# Altium schematic sheet 6_dc_dc_5V_Payloads.SchDoc: Payloads Step-Down Converters 5V/3A
size A4; DrawnBy: Sara V. Martínez; Engineer: Flight; DocumentNumber: 9; Revision: V0.1; SheetNumber: 9; SheetTotal: 11
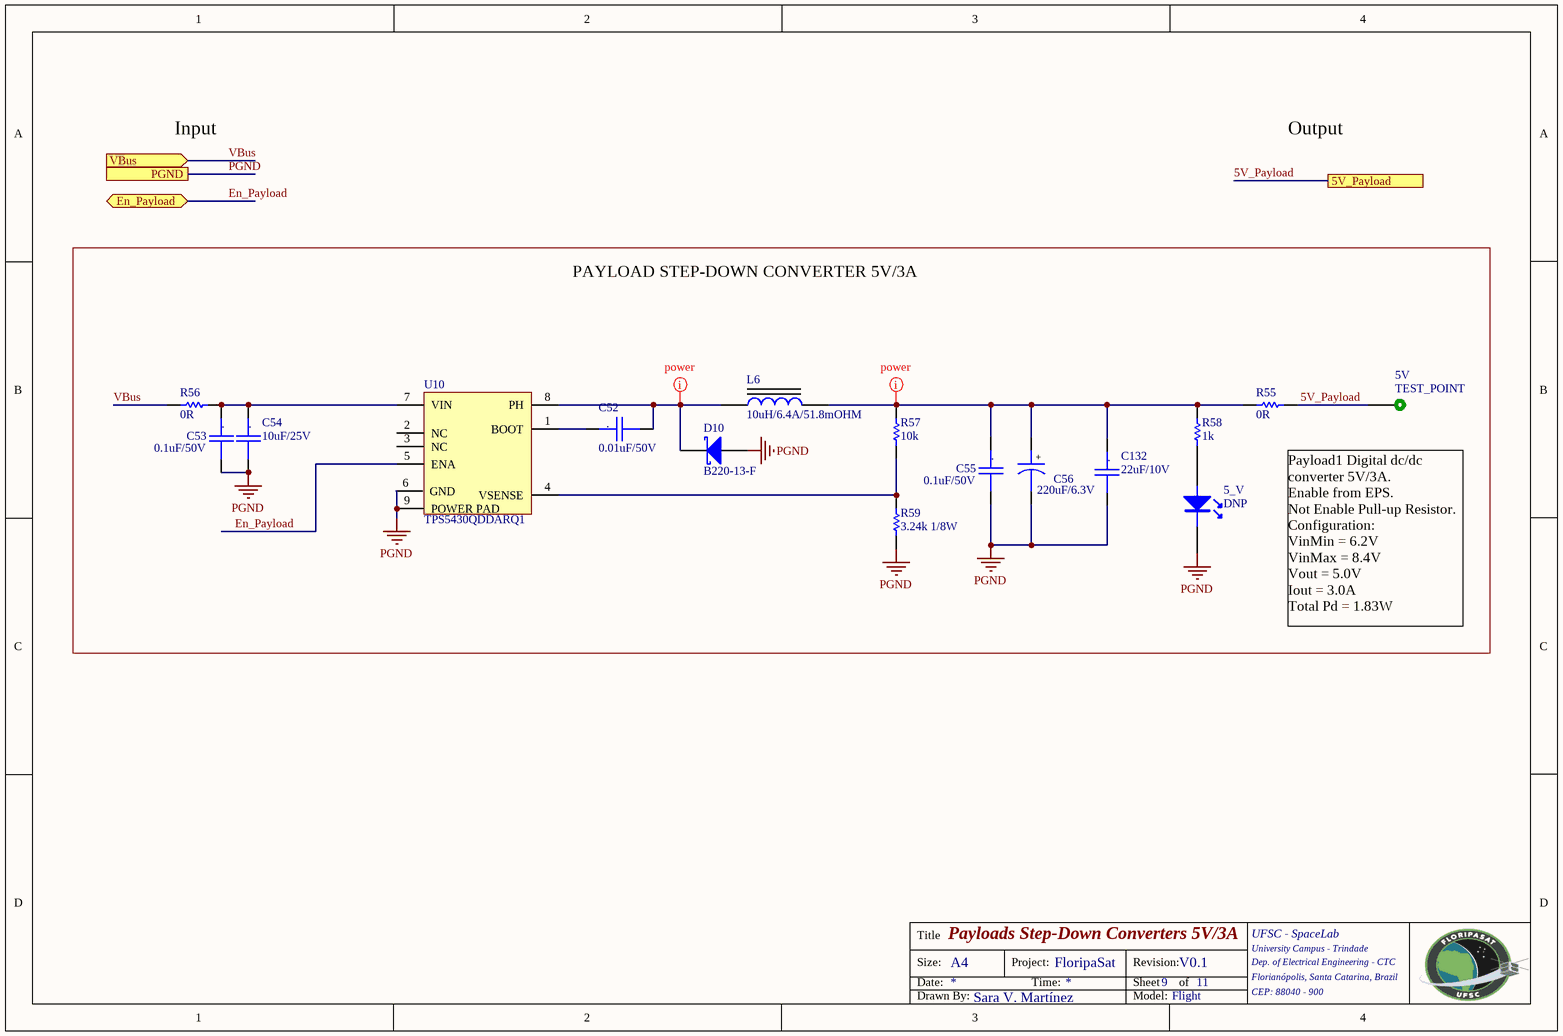
[diagram p0: 6_dc_dc_5V_Payloads.SchDoc]

## Parts
5_V  DNP  [0603-LED]
5V  TEST_POINT  [TEST_POINT]  (no BOM)
C52  0.01uF/50V  [CC0805]
C53  0.1uF/50V  [CC0805]
C54  10uF/25V  [CC1206]
C55  0.1uF/50V  [CC0805]
C56  220uF/6.3V  [cc1210]
C132  22uF/10V  [CC1206]
D10  B220-13-F  [DO-214AA]
L6  10uH/6.4A/51.8mOHM  [Ind_IHLP]
R55  0R  [1206]
R56  0R  [1206]
R57  10k  [0805]
R58  1k  [0603]
R59  3.24k 1/8W  [0805]
U10  TPS5430QDDARQ1  [SO8 Power PAD]

## Blocks framed on the sheet
PAYLOAD STEP-DOWN CONVERTER 5V/3A: 5_V 5V C52-C56 C132 D10 L6 R55-R59 U10

## Ports
5V_Payload, En_Payload (bidir), PGND, VBus (in)

## Nets
PGND: 5_V.2(K) C53.2 C54.2 C55.2 C56.2 C132.2 D10.2(A) R59.1 U10.6(GND) U10.9(POWER_PAD) ; port PGND
5V_Payload: 5V.1 R55.1 ; port 5V_Payload
En_Payload: U10.5(ENA) ; port En_Payload
VBus: R56.2 ; port VBus
Net5_V_1: 5_V.1(A) R58.2
NetC52_1: C52.1 U10.1(BOOT)
NetC52_2: C52.2 D10.1(K) L6.1 U10.8(PH)
NetC53_1: C53.1 C54.1 R56.1 U10.7(VIN)
NetC55_1: C55.1 C56.1 C132.1 L6.2 R55.2 R57.2 R58.1
NetR57_1: R57.1 R59.2 U10.4(VSENSE)

Not connected (* = marked no-connect by the designer): U10 2(NC) 3(NC)

## Layout directives
net class power: NetC52_2, NetC55_1

## Notes on the sheet
- Input
- Output
- Payload1 Digital dc/dc converter 5V/3A.
  Enable from EPS.
  Not Enable Pull-up Resistor.
  Configuration:
  VinMin = 6.2V
  VinMax = 8.4V
  Vout = 5.0V
  Iout = 3.0A
  Total Pd = 1.83W
- Title
- Size:
- Date:
- A4
- Project:
- Time:
- FloripaSat
- Revision:
- Sheet
- of
- UFSC - SpaceLab
- University Campus - Trindade
- Dep. of Electrical Engineering - CTC
- Florianópolis, Santa Catarina, Brazil
- Drawn By:
- Model:
- CEP: 88040 - 900
- (in symbol Cap_Cer_X7R_0.01uF_50V_0805) .
- (in symbol Cap_Cer_X7R_0.1uF_50V_0805) .
- (in symbol Cap_Cer_X7R_10uF_25V_1206) .
- (in symbol Cap_Cer_X7R_22uF_10V_1206) .
- (in symbol Cap_Tant_SMD_220uF_6.3V_1210) +

## Library data of the parts
5_V = LED/G_0603: SMD Green LED; Partnumber: 150060VS75000; Manufacturer: Wurth Electronics; Dominant Wavelength: 570nm; Forward Current: 30mA; Forward Voltage: 2V; Lens Style: Clear,Rectangular; Luminous Intensity: 40mcd; Test Current: 20mA; Viewing Angle: 140°; NCM: 8541.40.21; Case/Package: 0603; Case Code (Imperial): 0603; Case Code (Metric): 1608; Color: Green; ComponentLink1Description: https://katalog.we-online.de/led/datasheet/150060VS75000.pdf?src-supplier=Digi-Key; ComponentLink1URL: https://katalog.we-online.de/led/datasheet/150060VS75000.pdf?src-supplier=Digi-Key; Height: 0.7mm; Length: 1.6mm; Manufacturer Part Number: 150060VS75000; Max Operating Temperature: 85°C; Min Operating Temperature: -40°C; Mount: Surface Mount; Number of Pins: 2; Package Quantity: 1; Packaging: Tape and Reel; Pricing 1: 1=0.14, 10=0.138, 25=0.138, 50=0.129, 100=0.11, 250=0.11 (USD); Pricing 2: 1=0.14, 50=0.133, 100=0.114, 500=0.099 (USD); REACH SVHC: Unknown; Stock 1: 16336; Stock 2: 31910; Supplier 1: Mouser; Supplier 2: Digi-Key; Supplier Part Number 1: 710-150060VS75000; Supplier Part Number 2: 732-4980-1-ND; Wavelength: 570nm; Width: 0.8mm
5V = TEST_POINT: Test point
C52 = Cap_Cer_X7R_0.01uF_50V_0805: CAP CER 0.01uF 50V 10% X7R 0805; Partnumber: 08055C103KAT4A; Manufacturer: Kyocera AVX; Capacitance: 10nF; NCM: 8532.24.10; Case/Package: 0805; Case Code (Imperial): 0805; Case Code (Metric): 2012; ComponentLink1Description: http://www.mouser.com/ds/2/40/X7RDielectric-777024.pdf?src-supplier=Mouser; ComponentLink1URL: http://www.mouser.com/ds/2/40/X7RDielectric-777024.pdf?src-supplier=Mouser; ComponentLink2Description: http://www.avx.com/docs/Catalogs/cx7r.pdf?src-supplier=Future+Electronics; ComponentLink2URL: http://www.avx.com/docs/Catalogs/cx7r.pdf?src-supplier=Future+Electronics; Depth: 1.25mm; Dielectric: X7R; Height: 0.94mm; Lead Free: Lead Free; Length: 2.01mm; Manufacturer Part Number: 08055C103KAT4A; Max Operating Temperature: 125°C; Min Operating Temperature: -55°C; Mount: Surface Mount; Number of Pins: 2; Packaging: Tape and Reel; Pricing 1: 1=0.12, 10=0.085, 100=0.04, 500=0.028, 1000=0.023, 2500=0.018 (USD); Pricing 2: 1=0.13, 10=0.09, 50=0.0508, 100=0.0421, 500=0.02952, 1000=0.02444, 2500=0.02275, 5000=0.02081 (USD); Radiation Hardening: No; Stock 1: 88198; Stock 2: 515319; Supplier 1: Mouser; Supplier 2: Digi-Key; Supplier Part Number 1: 581-08055C103KAT4A; Supplier Part Number 2: 478-10687-1-ND; Termination: SMD/SMT; Tolerance: 10%; Voltage: 50V; Voltage Rating (DC): 50V; Voltage Rating: 50V; Weight: 0.000194oz; Width: 1.25mm
C53 C55 = Cap_Cer_X7R_0.1uF_50V_0805: CAP CER 0.1UF 50V 10% X7R 0805; Partnumber: CC0805KRX7R9BB104; Manufacturer: Yageo; Capacitance: 100nF; Insulation Resistance: 100GR; Material: Ceramic; Case/Package: 0805; Case Code (Imperial): 0805; Case Code (Metric): 2012; ComponentLink1Description: http://www.yageo.com/documents/recent/UPY-GPHC_X7R_6.3V-to-50V_8.pdf?src-supplier=Avnet; ComponentLink1URL: http://www.yageo.com/documents/recent/UPY-GPHC_X7R_6.3V-to-50V_8.pdf?src-supplier=Avnet; ComponentLink2Description: http://www.farnell.com/datasheets/1489800.pdf?src-supplier=Element14; ComponentLink2URL: http://www.farnell.com/datasheets/1489800.pdf?src-supplier=Element14; ComponentLink3Description: http://www.yageo.com/documents/recent/UPY-GPHC_X7R_6.3V-to-50V_18.pdf?src-supplier=Digi-Key; ComponentLink3URL: http://www.yageo.com/documents/recent/UPY-GPHC_X7R_6.3V-to-50V_18.pdf?src-supplier=Digi-Key; ComponentLink4Description: http://www.farnell.com/datasheets/2167236.pdf?src-supplier=Element14; ComponentLink4URL: http://www.farnell.com/datasheets/2167236.pdf?src-supplier=Element14; ComponentLink5Description: http://www.yageo.com/documents/recent/UPY-GPHC_X7R_6.3V-to-50V_8.pdf?src-supplier=Avnet+Europe; ComponentLink5URL: http://www.yageo.com/documents/recent/UPY-GPHC_X7R_6.3V-to-50V_8.pdf?src-supplier=Avnet+Europe; ComponentLink6Description: http://www.produktinfo.conrad.com/datenblaetter/425000-449999/445210-da-01-en-KERKO_CHIP_0805_X7R_0_1uF_10Proz_50VG.pdf?src-supplier=Conrad; ComponentLink6URL: http://www.produktinfo.conrad.com/datenblaetter/425000-449999/445210-da-01-en-KERKO_CHIP_0805_X7R_0_1uF_10Proz_50VG.pdf?src-supplier=Conrad; Depth: 1.25mm; Dielectric: X7R; Halogen Free: Halogen Free; Height: 0.85mm; Lead Free: Lead Free; Length: 2mm; Manufacturer Part Number: CC0805KRX7R9BB104; Max Operating Temperature: 125°C; Min Operating Temperature: -55°C; Mount: Surface Mount; Number of Pins: 2; Package Quantity: 1; Packaging: Tape and Reel; Pricing 1: 1=0.12, 10=0.087, 100=0.028, 1000=0.023, 4000=0.018, 8000=0.017 (USD); Pricing 2: 1=0.12, 10=0.088, 50=0.05, 100=0.0414, 500=0.02906, 1000=0.02405 (USD); Radiation Hardening: No; REACH SVHC: No SVHC; Stock 1: 3904445; Stock 2: 544494; Supplier 1: Mouser; Supplier 2: Digi-Key; Supplier Part Number 1: 603-CC805KRX7R9BB104; Supplier Part Number 2: 311-1140-1-ND; Termination: SMD/SMT; Thickness: 0.033inch; Tolerance: 10%; Voltage: 50V; Voltage Rating: 50V; Width: 0.049inch
C54 = Cap_Cer_X7R_10uF_25V_1206: CAP CER 10uF 25V 10% X7R 1206; Partnumber: GRM31CR71E106KA12L; Manufacturer: Murata; Material: Ceramic; NCM: 8532.24.10; Capacitance: 10uF; Case/Package: 1206; Case Code (Imperial): 1206; Case Code (Metric): 3216; ComponentLink1Description: http://www.mouser.com/ds/2/281/c02e-2905.pdf?src-supplier=Mouser; ComponentLink1URL: http://www.mouser.com/ds/2/281/c02e-2905.pdf?src-supplier=Mouser; ComponentLink2Description: http://www.farnell.com/datasheets/415311.pdf?src-supplier=Element14; ComponentLink2URL: http://www.farnell.com/datasheets/415311.pdf?src-supplier=Element14; ComponentLink3Description: http://www.farnell.com/datasheets/2048746.pdf?src-supplier=Element14; ComponentLink3URL: http://www.farnell.com/datasheets/2048746.pdf?src-supplier=Element14; ComponentLink4Description: http://uk.rs-online.com/webdocs/13d2/0900766b813d2ca8.pdf?src-supplier=RSComponents; ComponentLink4URL: http://uk.rs-online.com/webdocs/13d2/0900766b813d2ca8.pdf?src-supplier=RSComponents; ComponentLink5Description: http://search.murata.co.jp/Ceramy/image/img/A01X/partnumbering_e_01.pdf?src-supplier=Future+Electronics; ComponentLink5URL: http://search.murata.co.jp/Ceramy/image/img/A01X/partnumbering_e_01.pdf?src-supplier=Future+Electronics; ComponentLink6Description: https://www.distrelec.biz/Web/Downloads/_t/ds/murata_MLCC_eng_tds.pdf?mime=application%2Fpdf&src-supplier=Distrelec; ComponentLink6URL: https://www.distrelec.biz/Web/Downloads/_t/ds/murata_MLCC_eng_tds.pdf?mime=application%2Fpdf&src-supplier=Distrelec; ComponentLink7Description: https://www.murata.com/~/media/webrenewal/support/library/catalog/products/capacitor/mlcc/c02e.ashx?la=en-us&src-supplier=Digi-Key; ComponentLink7URL: https://www.murata.com/~/media/webrenewal/support/library/catalog/products/capacitor/mlcc/c02e.ashx?la=en-us&src-supplier=Digi-Key; ComponentLink8Description: http://components.arrow.com/part/dataview/46271255S8319800N2606?src-supplier=Arrow; ComponentLink8URL: http://components.arrow.com/part/dataview/46271255S8319800N2606?src-supplier=Arrow; ComponentLink9Description: http://www.farnell.com/datasheets/415311.pdf?src-supplier=Farnell; ComponentLink9URL: http://www.farnell.com/datasheets/415311.pdf?src-supplier=Farnell; ComponentLink10Description: http://www.produktinfo.conrad.com/datenblaetter/450000-474999/454935-da-01-en-VS_KONDENSATOR_1206.pdf?src-supplier=Conrad; ComponentLink10URL: http://www.produktinfo.conrad.com/datenblaetter/450000-474999/454935-da-01-en-VS_KONDENSATOR_1206.pdf?src-supplier=Conrad; ComponentLink11Description: http://www.produktinfo.conrad.com/datenblaetter/450000-474999/451104-da-01-de-VS_CHIP_KOND_1206_10_0_UF_10Pr_25_0V_X7R.pdf?src-supplier=Conrad; ComponentLink11URL: http://www.produktinfo.conrad.com/datenblaetter/450000-474999/451104-da-01-de-VS_CHIP_KOND_1206_10_0_UF_10Pr_25_0V_X7R.pdf?src-supplier=Conrad; Depth: 1.6mm; Dielectric: X7R; Height: 1.6mm; Lead Free: Lead Free; Length: 3.2mm; Manufacturer Part Number: GRM31CR71E106KA12L; Max Operating Temperature: 125°C; Min Operating Temperature: -55°C; Mount: Surface Mount; Number of Pins: 2; Package Quantity: 1; Packaging: Tape and Reel; Pricing 1: 1=0.83, 10=0.627, 100=0.448, 250=0.434, 500=0.347, 1000=0.299 (USD); Pricing 2: 1=0.88, 10=0.646, 50=0.517, 100=0.4431, 500=0.35082, 1000=0.29543 (USD); Radiation Hardening: No; REACH SVHC: No SVHC; Stock 1: 131052; Stock 2: 1515422; Supplier 1: Mouser; Supplier 2: Digi-Key; Supplier Part Number 1: 81-GRM31CR71E106KA12; Supplier Part Number 2: 490-6518-1-ND; Termination: SMD/SMT; Thickness: 0.071inch; Tolerance: 10%; Voltage: 25V; Voltage Rating (DC): 25V; Voltage Rating: 25V; Width: 1.6mm
C56 = Cap_Tant_SMD_220uF_6.3V_1210: CAP Tantalum 220uF 6.3V 20% 1210; Partnumber: 6TPE220MAZB; Manufacturer: Panasonic; Dissipation Factor: 10%; ESR (Equivalent Series Resistance): 35mR; Leakage Current: 138.6uA; Polarity: Polar; Ripple Current: 1.4A; NCM: 8532.21.11; Capacitance: 220uF; Case/Package: Molded; Case Code (Imperial): 1411; Case Code (Metric): 3528; ComponentLink1Description: http://www.farnell.com/datasheets/2059638.pdf?src-supplier=Element14; ComponentLink1URL: http://www.farnell.com/datasheets/2059638.pdf?src-supplier=Element14; ComponentLink2Description: https://www.verical.com/server-webapp/html/getDatasheet?partID=733772&src-supplier=Verical; ComponentLink2URL: https://www.verical.com/server-webapp/html/getDatasheet?partID=733772&src-supplier=Verical; ComponentLink3Description: https://www.distrelec.biz/Web/Downloads/_t/ds/tpe-series_eng_tds.pdf?mime=application%2Fpdf&src-supplier=Distrelec; ComponentLink3URL: https://www.distrelec.biz/Web/Downloads/_t/ds/tpe-series_eng_tds.pdf?mime=application%2Fpdf&src-supplier=Distrelec; ComponentLink4Description: http://industrial.panasonic.com/www-data/pdf/AAA8000/AAA8000CE5.pdf?src-supplier=Avnet; ComponentLink4URL: http://industrial.panasonic.com/www-data/pdf/AAA8000/AAA8000CE5.pdf?src-supplier=Avnet; ComponentLink5Description: http://www.mouser.com/ds/2/315/AAA8000C36-947358.pdf?src-supplier=Mouser; ComponentLink5URL: http://www.mouser.com/ds/2/315/AAA8000C36-947358.pdf?src-supplier=Mouser; Depth: 2.8mm; Features: General Purpose; Height - Seated (Max): 0.079inch; Height: 1.9mm; Lead Free: Lead Free; Length: 3.5mm; Manufacturer Part Number: 6TPE220MAZB; Max Operating Temperature: 105°C; Min Operating Temperature: -55°C; Mount: Surface Mount; Number of Pins: 2; Package Quantity: 2000; Packaging: Tape and Reel; Pricing 1: 1=1.63, 10=1.28, 100=0.964, 500=0.728, 1000=0.642, 2000=0.521 (USD); Pricing 2: 1=1.56, 10=1.23, 50=1.0656, 100=0.9222, 500=0.69676, 1000=0.61479 (USD); Radiation Hardening: No; REACH SVHC: No SVHC; Stock 1: 11237; Stock 2: 59078; Supplier 1: Mouser; Supplier 2: Digi-Key; Supplier Part Number 1: 667-6TPE220MAZB; Supplier Part Number 2: P16245CT-ND; Termination: SMD/SMT; Tolerance: 20%; Voltage: 6.3V; Voltage Rating (DC): 6.3V; Voltage Rating: 6.3V; Width: 0.11inch
C132 = Cap_Cer_X7R_22uF_10V_1206: CAP CER 22uF 10V 10% X7R 1206; Partnumber: GRM31CR71A226KE15L; Manufacturer: Murata; Material: Ceramic; NCM: 8532.24.10; Capacitance: 22uF; Case/Package: 1206; Case Code (Imperial): 1206; Case Code (Metric): 3216; ComponentLink1Description: http://components.arrow.com/part/dataview/46868660S8337524N2606?src-supplier=Arrow; ComponentLink1URL: http://components.arrow.com/part/dataview/46868660S8337524N2606?src-supplier=Arrow; ComponentLink2Description: http://uk.rs-online.com/webdocs/1423/0900766b81423c84.pdf?src-supplier=RSComponents; ComponentLink2URL: http://uk.rs-online.com/webdocs/1423/0900766b81423c84.pdf?src-supplier=RSComponents; ComponentLink3Description: https://www.murata.com/~/media/webrenewal/support/library/catalog/products/capacitor/mlcc/c02e.ashx?la=en-us&src-supplier=Digi-Key; ComponentLink3URL: https://www.murata.com/~/media/webrenewal/support/library/catalog/products/capacitor/mlcc/c02e.ashx?la=en-us&src-supplier=Digi-Key; ComponentLink4Description: http://www.farnell.com/datasheets/2048963.pdf?src-supplier=Farnell; ComponentLink4URL: http://www.farnell.com/datasheets/2048963.pdf?src-supplier=Farnell; ComponentLink5Description: http://www.farnell.com/datasheets/2048963.pdf?src-supplier=Element14; ComponentLink5URL: http://www.farnell.com/datasheets/2048963.pdf?src-supplier=Element14; ComponentLink6Description: http://psearch.en.murata.com/capacitor/product/GRM31CR71A226KE15%23.pdf?src-supplier=Avnet; ComponentLink6URL: http://psearch.en.murata.com/capacitor/product/GRM31CR71A226KE15%23.pdf?src-supplier=Avnet; ComponentLink7Description: http://psearch.murata.com/capacitor/product/GRM31CR71A226KE15%23.pdf?src-supplier=Avnet; ComponentLink7URL: http://psearch.murata.com/capacitor/product/GRM31CR71A226KE15%23.pdf?src-supplier=Avnet; ComponentLink8Description: https://www.distrelec.biz/Web/Downloads/_t/ds/murata_MLCC_eng_tds.pdf?mime=application%2Fpdf&src-supplier=Distrelec; ComponentLink8URL: https://www.distrelec.biz/Web/Downloads/_t/ds/murata_MLCC_eng_tds.pdf?mime=application%2Fpdf&src-supplier=Distrelec; ComponentLink9Description: http://psearch.murata.com/capacitor/product/GRM31CR71A226KE15%23.pdf?src-supplier=Future+Electronics; ComponentLink9URL: http://psearch.murata.com/capacitor/product/GRM31CR71A226KE15%23.pdf?src-supplier=Future+Electronics; ComponentLink10Description: http://www.produktinfo.conrad.com/datenblaetter/450000-474999/451412-da-01-de-VS_KONDENS_GRM31_CR71A_226KE15L.pdf?src-supplier=Conrad; ComponentLink10URL: http://www.produktinfo.conrad.com/datenblaetter/450000-474999/451412-da-01-de-VS_KONDENS_GRM31_CR71A_226KE15L.pdf?src-supplier=Conrad; ComponentLink11Description: http://www.produktinfo.conrad.com/datenblaetter/450000-474999/451120-da-01-de-VS_CHIP_KOND_1206_22_0_UF_10Pr_10_0V_X7R.pdf?src-supplier=Conrad; ComponentLink11URL: http://www.produktinfo.conrad.com/datenblaetter/450000-474999/451120-da-01-de-VS_CHIP_KOND_1206_22_0_UF_10Pr_10_0V_X7R.pdf?src-supplier=Conrad; Depth: 1.6mm; Dielectric: X7R; Height: 1.6mm; Lead Free: Lead Free; Length: 3.2mm; Manufacturer Part Number: GRM31CR71A226KE15L; Max Operating Temperature: 125°C; Min Operating Temperature: -55°C; Mount: Surface Mount; Package Quantity: 1; Packaging: Tape and Reel; Pricing 1: 1=1.11, 10=0.921, 100=0.697, 250=0.677, 500=0.527, 1000=0.464 (USD); Pricing 2: 1=1.13, 10=0.889, 50=0.7702, 100=0.6666, 500=0.50362, 1000=0.44438 (USD); Radiation Hardening: No; REACH SVHC: No SVHC; Stock 1: 113879; Stock 2: 339340; Supplier 1: Mouser; Supplier 2: Digi-Key; Supplier Part Number 1: 81-GRM31CR71A226K15L; Supplier Part Number 2: 490-5309-1-ND; Termination: SMD/SMT; Thickness: 0.071inch; Tolerance: 10%; Voltage: 10V; Voltage Rating (DC): 10V; Voltage Rating: 10V; Width: 0.063inch
D10 = DIODE_SCHOTTKY_20V_2A_MB220-13-F: DIODE SCHOTTKY 20V 2A B220-13-F; Manufacturer: Diodes; Capacitance: 200pF; Element Configuration: Single; Forward Voltage: 500mV; Max Forward Surge Current (Ifsm): 50A; Peak Reverse Current: 500uA; Polarity: Standard; NCM: 8541.10.29; Partnumber: B220-13-F; Average Rectified Current: 2A; Case/Package: SMB; ComponentLink1Description: http://www.diodes.com/datasheets/ds13004.pdf?src-supplier=Future+Electronics; ComponentLink1URL: http://www.diodes.com/datasheets/ds13004.pdf?src-supplier=Future+Electronics; ComponentLink2Description: http://www.diodes.com/datasheets/ds13004.pdf?src-supplier=Avnet; ComponentLink2URL: http://www.diodes.com/datasheets/ds13004.pdf?src-supplier=Avnet; Contact Plating: Tin,Matte; Current Rating: 2A; Forward Current: 2A; Height: 2.62mm; Lead Free: Lead Free; Length: 4.57mm; Manufacturer Part Number: B220-13-F; Max Operating Temperature: 150°C; Max Repetitive Reverse Voltage (Vrrm): 20V; Max Reverse Voltage (DC): 20V; Min Operating Temperature: -65°C; Mount: Surface Mount; Number of Pins: 2; Output Current: 2A; Package Quantity: 3000; Packaging: Tape and Reel; Peak Non-Repetitive Surge Current: 50A; Pricing 1: 1=0.45, 10=0.289, 100=0.124, 1000=0.095, 3000=0.072, 9000=0.064 (USD); Pricing 2: 1=0.46, 10=0.339, 25=0.2968, 100=0.1612, 250=0.16036, 500=0.1315, 1000=0.09757 (USD); Radiation Hardening: No; REACH SVHC: No SVHC; Stock 1: 3454; Stock 2: 5768; Supplier 1: Mouser; Supplier 2: Digi-Key; Supplier Part Number 1: 621-B220-F; Supplier Part Number 2: B220-FDICT-ND; Termination: SMD/SMT; Voltage Rating (DC): 20V; Weight: 0.00328oz; Width: 3.94mm
L6 = IND_POWER_10uH_6.4A_51.8mR: INDUCTOR 2.2UH 6.4A SMD; Partnumber: IHLP3232DZER100M11; Manufacturer: Vishay Dale; Core Material: Ferrite; Current Rating: 5.4A; DC Resistance (DCR): 51.8mR; Inductance: 10uH; Inductance Tolerance: 20%; Self Resonant Frequency: 12MHz; Shielding: Shielded; Test Frequency: 100kHz; NCM: 8504.50.00; Case/Package: 3232; ComponentLink1Description: http://www.vishay.com/docs/34313/ihlp3232dz11.pdf?src-supplier=Avnet; ComponentLink1URL: http://www.vishay.com/docs/34313/ihlp3232dz11.pdf?src-supplier=Avnet; ComponentLink2Description: http://www.vishay.com/docs/34313/ihlp3232dz11.pdf?src-supplier=Digi-Key; ComponentLink2URL: http://www.vishay.com/docs/34313/ihlp3232dz11.pdf?src-supplier=Digi-Key; ComponentLink3Description: https://www.alliedelec.com/m/d/5924ead94cc8907f6647c63e8202e128.pdf?src-supplier=Allied+Electronics; ComponentLink3URL: https://www.alliedelec.com/m/d/5924ead94cc8907f6647c63e8202e128.pdf?src-supplier=Allied+Electronics; ComponentLink4Description: http://www.farnell.com/datasheets/2045896.pdf?src-supplier=Element14; ComponentLink4URL: http://www.farnell.com/datasheets/2045896.pdf?src-supplier=Element14; ComponentLink5Description: http://www.vishay.com/docs/34313/ihlp3232dz11.pdf?src-supplier=Element14; ComponentLink5URL: http://www.vishay.com/docs/34313/ihlp3232dz11.pdf?src-supplier=Element14; Contact Plating: Tin; Depth: 8.26mm; Height - Seated (Max): 0.157inch; Height: 4mm; Lead Free: Lead Free; Length: 8.89mm; Manufacturer Part Number: IHLP3232DZER100M11; Max DC Current: 5.4A; Max Operating Temperature: 125°C; Military Standard: Not; Min Operating Temperature: -55°C; Mount: Surface Mount; Number of Pins: 2; Package Quantity: 500; Packaging: Tape and Reel; Pricing 1: 1=1.65, 10=1.53, 100=0.738, 1000=0.738, 2500=0.738, 10000=0.738 (USD); Pricing 2: 1=1.58, 10=1.466, 25=1.3532, 50=1.1276, 100=1.0599, 250=0.94712 (USD); Radiation Hardening: No; REACH SVHC: Unknown; RMS Current (Irms): 5.4A; Saturation Current: 6.4A; Stock 1: 376; Stock 2: 12872; Supplier 1: Mouser; Supplier 2: Digi-Key; Supplier Part Number 1: 70-IHLP3232DZER100M1; Supplier Part Number 2: 541-1346-1-ND; Termination: SMD/SMT; Tolerance: 20%; Width: 8.18mm
R55 R56 = R0R_JUMPER_3/4W_1206: RES 0.0 OHM 3/4W JUMP 1206; Partnumber: HCJ1206ZT0R00; Manufacturer: Stackpole Electronics; Resistance: 0mR; Fitted: No (jumper resistor); Case/Package: 1206; Case Code (Imperial): 1206; Case Code (Metric): 3216; ComponentLink1Description: http://www.seielect.com/Catalog/SEI-HCJ.pdf?src-supplier=Avnet; ComponentLink1URL: http://www.seielect.com/Catalog/SEI-HCJ.pdf?src-supplier=Avnet; ComponentLink2Description: https://www.seielect.com/Catalog/SEI-HCJ.pdf?src-supplier=Avnet+Asia; ComponentLink2URL: https://www.seielect.com/Catalog/SEI-HCJ.pdf?src-supplier=Avnet+Asia; ComponentLink3Description: https://www.seielect.com/catalog/SEI-HCJ.pdf?src-supplier=Digi-Key; ComponentLink3URL: https://www.seielect.com/catalog/SEI-HCJ.pdf?src-supplier=Digi-Key; ComponentLink4Description: https://www.seielect.com/catalog/SEI-Packaging.pdf?src-supplier=Digi-Key; ComponentLink4URL: https://www.seielect.com/catalog/SEI-Packaging.pdf?src-supplier=Digi-Key; Features: Automotive AEC-Q200; Height: 0.026inch; Length: 0.122inch; Manufacturer Part Number: HCJ1206ZT0R00; Max Operating Temperature: 155°C; Min Operating Temperature: -55°C; Mount: Surface Mount; Number of Terminations: 2; Package Quantity: 5000; Packaging: Tape and Reel; Pricing 1: 1=0.5, 10=0.358, 25=0.2788, 50=0.236, 100=0.1859, 250=0.15732, 500=0.1287, 1000=0.1001 (USD); Radiation Hardening: No; Stock 1: 1958428; Supplier 1: Digi-Key; Supplier Part Number 1: HCJ1206ZT0R00CT-ND; Termination: Wraparound; Width: 0.061inch
R57 = R10k_1%_1/8W_0805: RES 10K OHM 1/8W 1%  0805; Partnumber: CRCW080510K0FKEA; Manufacturer: Vishay; Power Rating: 125mW; Resistance: 10kR; Temperature Coefficient: 100ppm/°C; Voltage Rating (DC): 150V; NCM: 8533.21.20; Case/Package: 0805; Case Code (Imperial): 0805; Case Code (Metric): 2012; ComponentLink1Description: http://www.mouser.com/ds/2/427/dcrcwe3-109170.pdf?src-supplier=Mouser; ComponentLink1URL: http://www.mouser.com/ds/2/427/dcrcwe3-109170.pdf?src-supplier=Mouser; ComponentLink2Description: http://uk.rs-online.com/webdocs/0d98/0900766b80d98b26.pdf?src-supplier=RSComponents; ComponentLink2URL: http://uk.rs-online.com/webdocs/0d98/0900766b80d98b26.pdf?src-supplier=RSComponents; ComponentLink3Description: http://www.alliedelec.com/m/d/0c934d6939ccefa68dbe0b96d821c8cf.pdf?src-supplier=Allied+Electronics; ComponentLink3URL: http://www.alliedelec.com/m/d/0c934d6939ccefa68dbe0b96d821c8cf.pdf?src-supplier=Allied+Electronics; ComponentLink4Description: http://www.vishay.com/docs/20035/dcrcwe3.pdf?src-supplier=Avnet+Asia; ComponentLink4URL: http://www.vishay.com/docs/20035/dcrcwe3.pdf?src-supplier=Avnet+Asia; ComponentLink5Description: http://www.vishay.com/docs/20035/dcrcwe3.pdf?src-supplier=Avnet+Europe; ComponentLink5URL: http://www.vishay.com/docs/20035/dcrcwe3.pdf?src-supplier=Avnet+Europe; ComponentLink6Description: http://www.farnell.com/datasheets/2310790.pdf?src-supplier=Element14; ComponentLink6URL: http://www.farnell.com/datasheets/2310790.pdf?src-supplier=Element14; ComponentLink7Description: http://www.vishay.com/docs/20035/dcrcwe3.pdf?src-supplier=Avnet; ComponentLink7URL: http://www.vishay.com/docs/20035/dcrcwe3.pdf?src-supplier=Avnet; ComponentLink8Description: http://www.vishay.com/docs/20035/dcrcwe3.pdf?src-supplier=Future+Electronics; ComponentLink8URL: http://www.vishay.com/docs/20035/dcrcwe3.pdf?src-supplier=Future+Electronics; Composition: Thick Film; Contact Plating: Tin; Depth: 1.25mm; Height: 0.45mm; Lead Free: Lead Free; Length: 2mm; Manufacturer Part Number: CRCW080510K0FKEA; Max Operating Temperature: 155°C; Military Standard: Not; Min Operating Temperature: -55°C; Package Quantity: 5000; Packaging: Tape and Reel; Pricing 1: 1=0.1, 10=0.062, 100=0.025, 1000=0.01, 5000=0.007, 10000=0.006 (USD); Pricing 2: 1=0.1, 10=0.062, 100=0.0254, 1000=0.01142, 2500=0.00991 (USD); Radiation Hardening: No; REACH SVHC: Unknown; Stock 1: 1328419; Stock 2: 975000; Supplier 1: Mouser; Supplier 2: Digi-Key; Supplier Part Number 1: 71-CRCW0805-10K-E3; Supplier Part Number 2: 541-10.0KCDKR-ND; Termination: SMD/SMT; Tolerance: 1%; Voltage Rating: 150V; Weight: 0.000194oz; Width: 1.25mm
R58 = R1.0k_1%_1/8W_0603: RES 1.0K OHM 1/8W 1% 0603; Partnumber: MCT06030C1001FP500; Manufacturer: Vishay; Max Power Dissipation: 125mW; Power Rating: 100mW; Resistance: 1kR; Temperature Coefficient: 50ppm/°C; Voltage Rating (DC): 75V; NCM: 8533.21.20; Case/Package: 0603; Case Code (Imperial): 0603; Case Code (Metric): 1608; ComponentLink1Description: http://www.vishay.com/docs/28705/mcx0x0xpro.pdf?src-supplier=Digi-Key; ComponentLink1URL: http://www.vishay.com/docs/28705/mcx0x0xpro.pdf?src-supplier=Digi-Key; ComponentLink2Description: http://www.vishay.com/docs/28705/mc_pro.pdf?src-supplier=Avnet+Europe; ComponentLink2URL: http://www.vishay.com/docs/28705/mc_pro.pdf?src-supplier=Avnet+Europe; ComponentLink3Description: http://www.vishay.com/docs/28705/mc_pro.pdf?src-supplier=Avnet; ComponentLink3URL: http://www.vishay.com/docs/28705/mc_pro.pdf?src-supplier=Avnet; ComponentLink4Description: http://www.vishay.com/docs/28705/mc_pro.pdf?src-supplier=Future+Electronics; ComponentLink4URL: http://www.vishay.com/docs/28705/mc_pro.pdf?src-supplier=Future+Electronics; Composition: Thin Film; Contact Plating: Tin; Depth: 0.85mm; Height: 0.022inch; Lead Free: Lead Free; Length: 1.55mm; Manufacturer Part Number: MCT06030C1001FP500; Max Operating Temperature: 125°C; Military Standard: Not; Min Operating Temperature: -55°C; Mount: Surface Mount; Number of Terminations: 2; Package Quantity: 1; Packaging: Tape and Reel; Pricing 1: 1=0.1, 1000=0.025, 2000=0.023, 5000=0.019, 10000=0.018, 20000=0.017 (USD); Pricing 2: 1=0.17, 10=0.145, 100=0.0568, 1000=0.02376, 2500=0.02178 (USD); Radiation Hardening: No; REACH SVHC: Unknown; Stock 1: 142157; Stock 2: 268907; Supplier 1: Mouser; Supplier 2: Digi-Key; Supplier Part Number 1: 594-MCT06030C1001FP5; Supplier Part Number 2: MCT0603-1.00K-CFCT-ND; Termination: SMD/SMT; Tolerance: 1%; Voltage Rating: 75V; Weight: 7.1E-05oz; Width: 0.033inch
R59 = R3.24k_1%_1/8W_0805: RES 3.24k OHM 1/8W 1% 0805 SMD; Partnumber: CRCW08053K24FKEA; Manufacturer: Vishay; Max Power Dissipation: 125mW; Resistance: 3.24kR; Temperature Coefficient: 100ppm/°C; Voltage Rating (DC): 150V; NCM: 8533.21.20; Case/Package: 0805; Case Code (Imperial): 0805; Case Code (Metric): 2012; ComponentLink1Description: http://www.vishay.com/docs/20035/dcrcwe3.pdf?src-supplier=Avnet; ComponentLink1URL: http://www.vishay.com/docs/20035/dcrcwe3.pdf?src-supplier=Avnet; ComponentLink2Description: http://www.vishay.com/docs/20035/dcrcwe3.pdf?src-supplier=Digi-Key; ComponentLink2URL: http://www.vishay.com/docs/20035/dcrcwe3.pdf?src-supplier=Digi-Key; ComponentLink3Description: https://www.alliedelec.com/m/d/0c934d6939ccefa68dbe0b96d821c8cf.pdf?src-supplier=Allied+Electronics; ComponentLink3URL: https://www.alliedelec.com/m/d/0c934d6939ccefa68dbe0b96d821c8cf.pdf?src-supplier=Allied+Electronics; ComponentLink4Description: http://www.farnell.com/datasheets/2111203.pdf?src-supplier=Element14; ComponentLink4URL: http://www.farnell.com/datasheets/2111203.pdf?src-supplier=Element14; ComponentLink5Description: http://www.farnell.com/datasheets/2049244.pdf?src-supplier=Element14; ComponentLink5URL: http://www.farnell.com/datasheets/2049244.pdf?src-supplier=Element14; Composition: Thick Film; Contact Plating: Tin; Depth: 1.25mm; Features: Automotive AEC-Q200; Height: 0.02inch; Lead Free: Lead Free; Length: 2mm; Manufacturer Part Number: CRCW08053K24FKEA; Max Operating Temperature: 155°C; Military Standard: Not; Min Operating Temperature: -55°C; Number of Pins: 2; Number of Terminations: 2; Package Quantity: 10; Packaging: Tape and Reel; Power Rating: 125mW; Pricing 1: 1=0.1, 10=0.062, 100=0.025, 1000=0.01, 5000=0.007, 10000=0.006 (USD); Pricing 2: 1=0.1, 10=0.062, 100=0.0254, 1000=0.01142, 2500=0.00991 (USD); Radiation Hardening: No; REACH SVHC: Unknown; Stock 1: 17870; Stock 2: 7978; Supplier 1: Mouser; Supplier 2: Digi-Key; Supplier Part Number 1: 71-CRCW0805-3.24K-E3; Supplier Part Number 2: 541-3.24KCCT-ND; Termination: Solder; Tolerance: 1%; Voltage Rating: 150V; Weight: 0.000194oz; Width: 1.25mm
U10 = TPS5430QDDARQ1: Manufacturer: Texas Instruments; Efficiency: 95%; Max Input Voltage: 36V; Max Output Current: 3A; Max Output Voltage: 31V; Min Input Voltage: 5.5V; Min Output Voltage: 1.22V; Number of Outputs: 1; Output Type: Adjustable; Quiescent Current: 3mA; Switching Frequency: 500kHz; Synchronous Rectifier: No; Partnumber: TPS5430QDDARQ1; ComponentLink1Description: http://www.ti.com/general/docs/lit/getliterature.tsp?genericPartNumber=TPS5430-Q1&&fileType=pdf&src-supplier=Avnet; ComponentLink1URL: http://www.ti.com/general/docs/lit/getliterature.tsp?genericPartNumber=TPS5430-Q1&&fileType=pdf&src-supplier=Avnet; ComponentLink2Description: http://focus.ti.com/lit/ds/symlink/tps5430-q1.pdf?src-supplier=Avnet+Europe; ComponentLink2URL: http://focus.ti.com/lit/ds/symlink/tps5430-q1.pdf?src-supplier=Avnet+Europe; ComponentLink3Description: http://www.ti.com/lit/ds/symlink/tps5430-q1.pdf?src-supplier=Digi-Key; ComponentLink3URL: http://www.ti.com/lit/ds/symlink/tps5430-q1.pdf?src-supplier=Digi-Key; ComponentLink4Description: http://www.farnell.com/datasheets/2019094.pdf?src-supplier=Element14; ComponentLink4URL: http://www.farnell.com/datasheets/2019094.pdf?src-supplier=Element14; ComponentLink5Description: http://www.ti.com/lit/gpn/tps5430-q1?src-supplier=Mouser; ComponentLink5URL: http://www.ti.com/lit/gpn/tps5430-q1?src-supplier=Mouser; ComponentLink6Description: http://datasheet.iiic.cc/texas_instruments/TPS5430QDDARQ1.pdf?src-supplier=IIIC; ComponentLink6URL: http://datasheet.iiic.cc/texas_instruments/TPS5430QDDARQ1.pdf?src-supplier=IIIC; Lead Free: Lead Free; Manufacturer Part Number: TPS5430QDDARQ1; Max Operating Temperature: 125°C; Min Operating Temperature: -40°C; Mount: Surface Mount; Number of Pins: 8; Operating Supply Voltage: 36V; Output Current: 3A; Output Voltage: 31V; Package Quantity: 2500; Packaging: Tape and Reel; Pricing 1: 1=4.82, 10=4.32, 25=4.09, 100=3.36, 250=3.02, 500=2.91 (USD); Pricing 2: 1=4.81, 10=4.32, 25=4.0836, 100=3.3578, 250=3.01292, 500=2.904, 1000=2.41395 (USD); Radiation Hardening: No; REACH SVHC: No SVHC; Stock 1: 2625; Stock 2: 2162; Supplier 1: Mouser; Supplier 2: Digi-Key; Supplier Part Number 1: 595-TPS5430QDDARQ1; Supplier Part Number 2: 296-23177-1-ND; Weight: 0.00249oz